# EAGLE design Nixie-Treiber_1_0 (EAGLE 7.3.0)

## Sheet 1 of 3
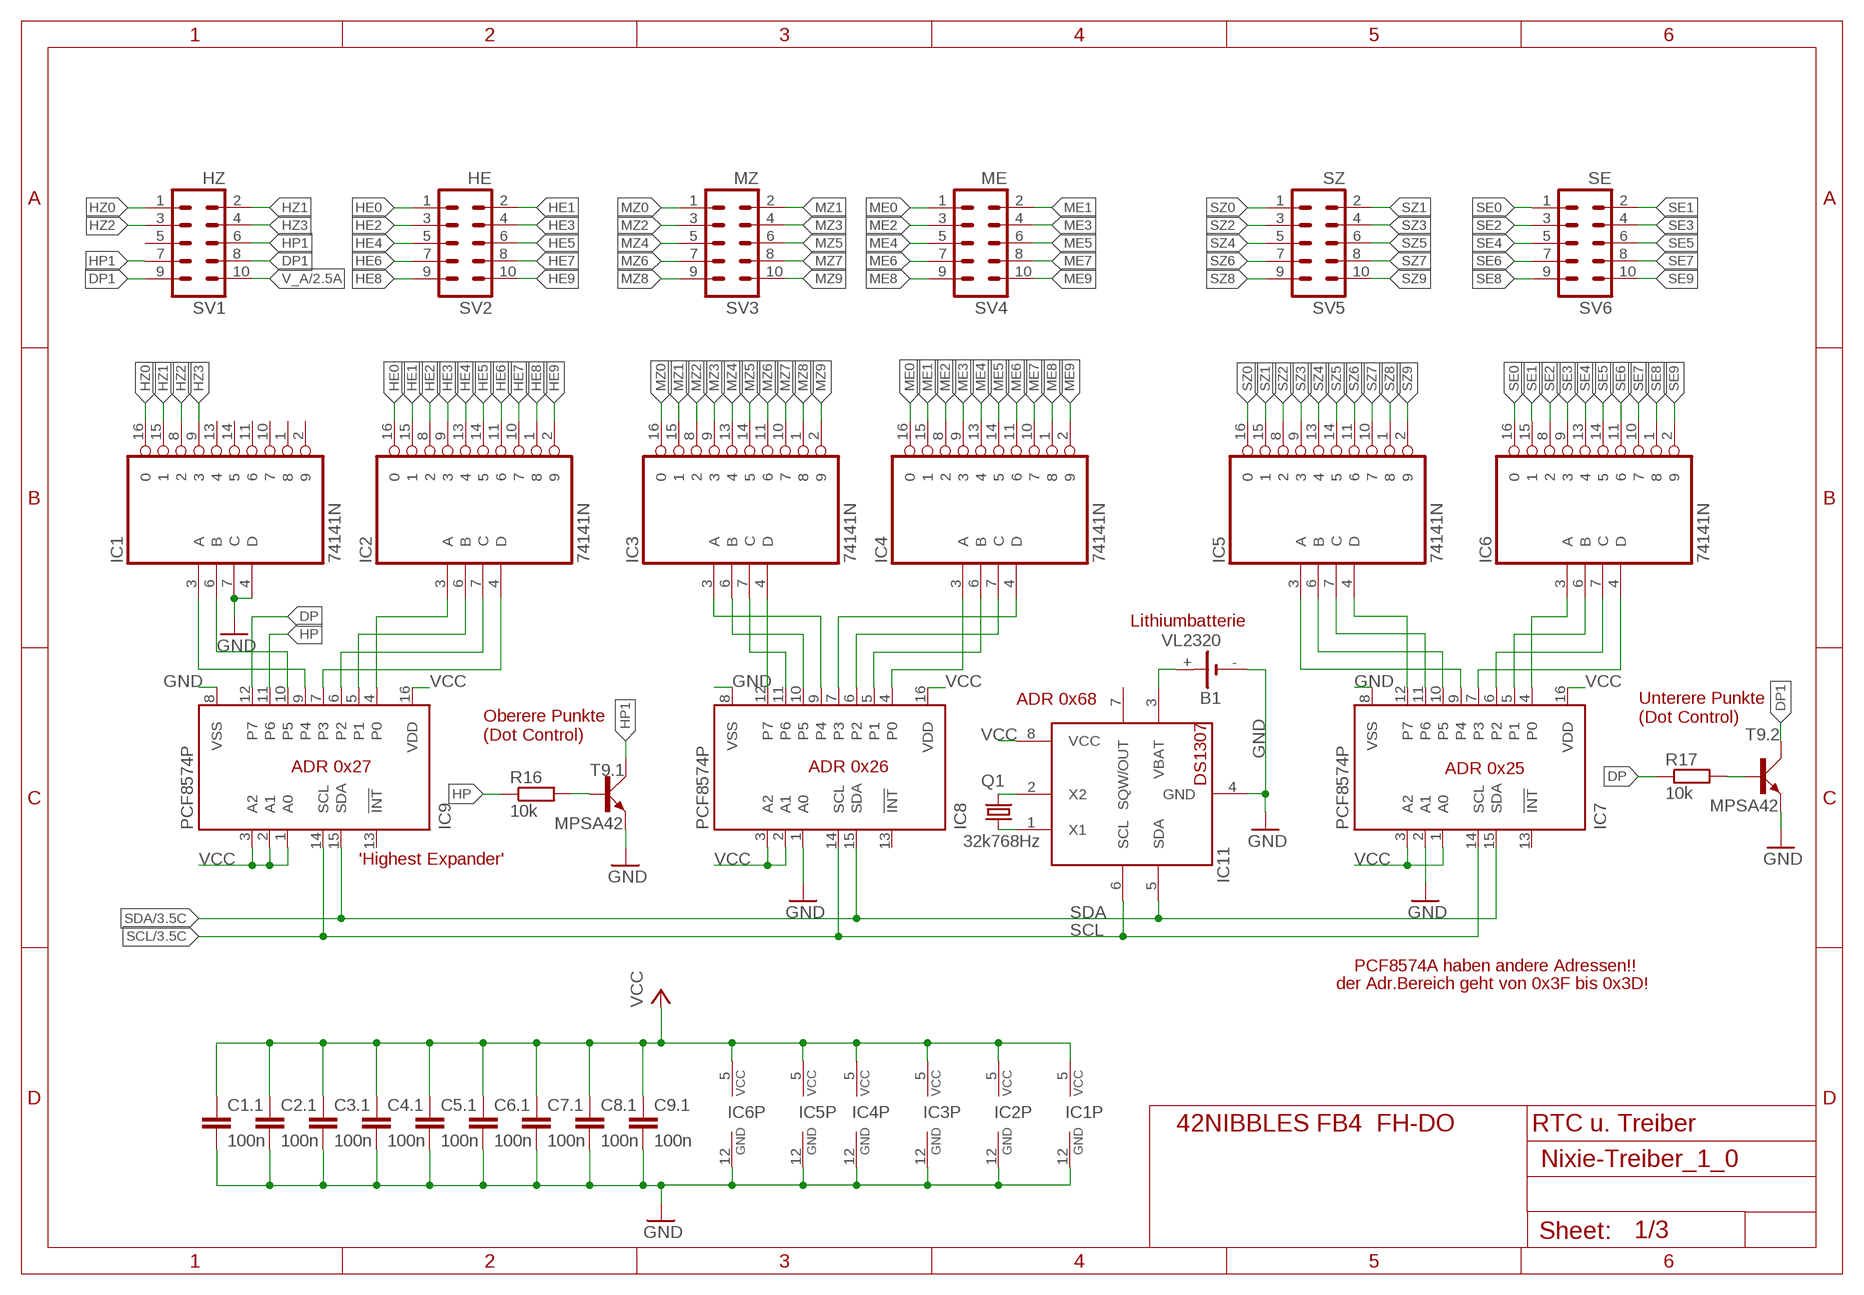
[diagram p0: schematic, sheet 1]

### Parts
B1  VL2320  VL3220  [VL2320]
C1.1  100n  C-EU050-024X044  [C050-024X044]
C2.1  100n  C-EU050-024X044  [C050-024X044]
C3.1  100n  C-EU050-024X044  [C050-024X044]
C4.1  100n  C-EU050-024X044  [C050-024X044]
C5.1  100n  C-EU050-024X044  [C050-024X044]
C6.1  100n  C-EU050-024X044  [C050-024X044]
C7.1  100n  C-EU050-024X044  [C050-024X044]
C8.1  100n  C-EU050-024X044  [C050-024X044]
C9.1  100n  C-EU050-024X044  [C050-024X044]
IC1  74141N  [DIL16]
IC2  74141N  [DIL16]
IC3  74141N  [DIL16]
IC4  74141N  [DIL16]
IC5  74141N  [DIL16]
IC6  74141N  [DIL16]
IC7  PCF8574P  [DIL16]
IC8  PCF8574P  [DIL16]
IC9  PCF8574P  [DIL16]
IC11  DS1307  [DIL08]
Q1  32k768Hz  CRYSTALTC38H  [TC38H]
R16  10k  R-EU_0207/10  [0207/10]
R17  10k  R-EU_0207/10  [0207/10]
SV1  HZ  ML10  [ML10]
SV2  HE  ML10  [ML10]
SV3  MZ  ML10  [ML10]
SV4  ME  ML10  [ML10]
SV5  SZ  ML10  [ML10]
SV6  SE  ML10  [ML10]
T9.1  MPSA42  [TO92D]
T9.2  MPSA42  [TO92D]

### Nets
DP: IC9.12(P7) R17.1
DP1: SV1.8 SV1.9 T9.2.C
GND: B1.- C1.1.2 C2.1.2 C3.1.2 C4.1.2 C5.1.2 C6.1.2 C7.1.2 C8.1.2 C9.1.2 IC1.4(D) IC1.7(C) IC1.12(GND) IC2.12(GND) IC3.12(GND) IC4.12(GND) IC5.12(GND) IC6.12(GND) IC7.2(A1) IC7.8(VSS) IC8.1(A0) IC8.8(VSS) IC9.8(VSS) IC11.4(GND) T9.1.E T9.2.E ; also sheet 2,3
HE0: IC2.16 SV2.1
HE1: IC2.15 SV2.2
HE2: IC2.8 SV2.3
HE3: IC2.9 SV2.4
HE4: IC2.13 SV2.5
HE5: IC2.14 SV2.6
HE6: IC2.11 SV2.7
HE7: IC2.10 SV2.8
HE8: IC2.1 SV2.9
HE9: IC2.2 SV2.10
HP: IC9.11(P6) R16.1
HP1: SV1.6 SV1.7 T9.1.C
HZ0: IC1.16 SV1.1
HZ1: IC1.15 SV1.2
HZ2: IC1.8 SV1.3
HZ3: IC1.9 SV1.4
ME0: IC4.16 SV4.1
ME1: IC4.15 SV4.2
ME2: IC4.8 SV4.3
ME3: IC4.9 SV4.4
ME4: IC4.13 SV4.5
ME5: IC4.14 SV4.6
ME6: IC4.11 SV4.7
ME7: IC4.10 SV4.8
ME8: IC4.1 SV4.9
ME9: IC4.2 SV4.10
MZ0: IC3.16 SV3.1
MZ1: IC3.15 SV3.2
MZ2: IC3.8 SV3.3
MZ3: IC3.9 SV3.4
MZ4: IC3.13 SV3.5
MZ5: IC3.14 SV3.6
MZ6: IC3.11 SV3.7
MZ7: IC3.10 SV3.8
MZ8: IC3.1 SV3.9
MZ9: IC3.2 SV3.10
N$1: IC2.3(A) IC9.4(P0)
N$2: IC2.6(B) IC9.5(P1)
N$3: IC2.7(C) IC9.6(P2)
N$4: IC2.4(D) IC9.7(P3)
N$5: IC1.3(A) IC9.9(P4)
N$6: IC1.6(B) IC9.10(P5)
N$7: R16.2 T9.1.B
N$8: R17.2 T9.2.B
N$9: IC4.3(A) IC8.4(P0)
N$10: IC4.6(B) IC8.5(P1)
N$11: IC4.7(C) IC8.6(P2)
N$12: IC4.4(D) IC8.7(P3)
N$13: IC3.3(A) IC8.9(P4)
N$14: IC3.6(B) IC8.10(P5)
N$15: IC3.7(C) IC8.11(P6)
N$16: IC3.4(D) IC8.12(P7)
N$17: IC6.3(A) IC7.4(P0)
N$18: IC6.6(B) IC7.5(P1)
N$19: IC6.7(C) IC7.6(P2)
N$20: IC6.4(D) IC7.7(P3)
N$21: IC5.3(A) IC7.9(P4)
N$22: IC5.6(B) IC7.10(P5)
N$23: IC5.7(C) IC7.11(P6)
N$24: IC5.4(D) IC7.12(P7)
N$25: IC11.1(X1) Q1.1
N$26: IC11.2(X2) Q1.2
N$27: B1.+ IC11.3(VBAT)
SCL: IC7.14(SCL) IC8.14(SCL) IC9.14(SCL) IC11.6(SCL) ; also sheet 3
SDA: IC7.15(SDA) IC8.15(SDA) IC9.15(SDA) IC11.5(SDA) ; also sheet 3
SE0: IC6.16 SV6.1
SE1: IC6.15 SV6.2
SE2: IC6.8 SV6.3
SE3: IC6.9 SV6.4
SE4: IC6.13 SV6.5
SE5: IC6.14 SV6.6
SE6: IC6.11 SV6.7
SE7: IC6.10 SV6.8
SE8: IC6.1 SV6.9
SE9: IC6.2 SV6.10
SZ0: IC5.16 SV5.1
SZ1: IC5.15 SV5.2
SZ2: IC5.8 SV5.3
SZ3: IC5.9 SV5.4
SZ4: IC5.13 SV5.5
SZ5: IC5.14 SV5.6
SZ6: IC5.11 SV5.7
SZ7: IC5.10 SV5.8
SZ8: IC5.1 SV5.9
SZ9: IC5.2 SV5.10
V_A: SV1.10 ; also sheet 2
VCC: C1.1.1 C2.1.1 C3.1.1 C4.1.1 C5.1.1 C6.1.1 C7.1.1 C8.1.1 C9.1.1 IC1.5(VCC) IC2.5(VCC) IC3.5(VCC) IC4.5(VCC) IC5.5(VCC) IC6.5(VCC) IC7.1(A0) IC7.3(A2) IC7.16(VDD) IC8.2(A1) IC8.3(A2) IC8.16(VDD) IC9.1(A0) IC9.2(A1) IC9.3(A2) IC9.16(VDD) IC11.8(VCC) ; also sheet 2,3
Unconnected: IC1.1 IC1.2 IC1.10 IC1.11 IC1.13 IC1.14 IC7.13(!INT) IC8.13(!INT) IC9.13(!INT) IC11.7(SQW/OUT) SV1.5

### Notes on the sheet
- Lithiumbatterie
- ADR 0x68
- Unterere Punkte
  (Dot Control)
- Oberere Punkte
  (Dot Control)
- ADR 0x27 | ADR 0x26 | ADR 0x25
- 'Highest Expander'
- PCF8574A haben andere Adressen!!
- der Adr.Bereich geht von 0x3F bis 0x3D!
- 42NIBBLES FB4  FH-DO | RTC u. Treiber

## Sheet 2 of 3
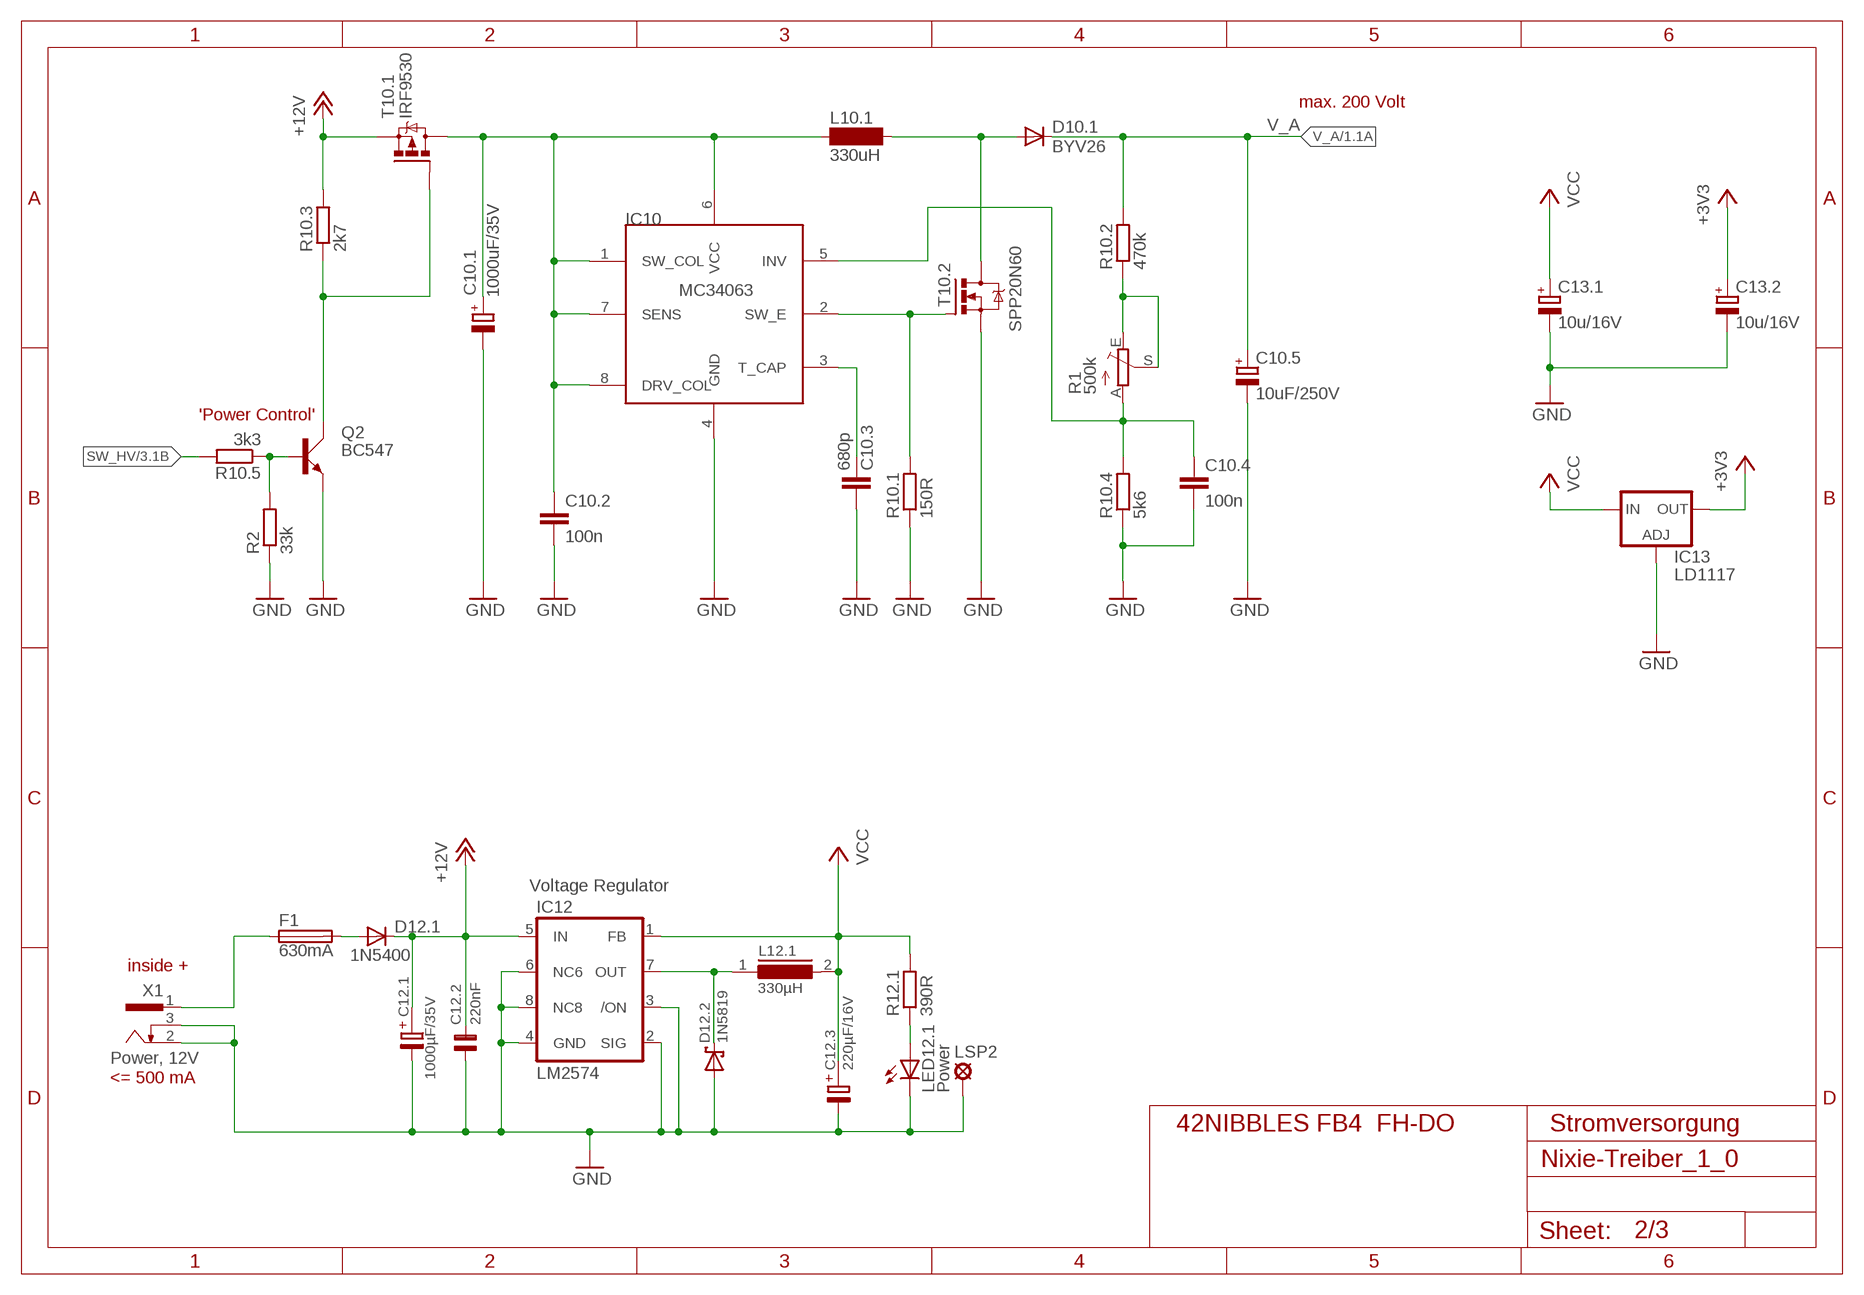
[diagram p1: schematic, sheet 2]

### Parts
C10.1  1000uF/35V  CPOL-EUE5-13  [E5-13]
C10.2  100n  C-EU050-030X075  [C050-030X075]
C10.3  680p  C-EU025-025X050  [C025-025X050]
C10.4  100n  C-EU050-030X075  [C050-030X075]
C10.5  10uF/250V  CPOL-EUE5-13  [E5-13]
C12.1  1000µF/35V  E5-13  [E5-13]
C12.2  220nF  C5B2,5  [C5B2,5]
C12.3  220µF/16V  E5-10,5  [E5-10,5]
C13.1  10u/16V  CPOL-EUE1.8-4  [E1,8-4]
C13.2  10u/16V  CPOL-EUE1.8-4  [E1,8-4]
D10.1  BYV26  1N5059  [DO204-10]
D12.1  1N5400  [DO201-15]
D12.2  1N5819  1N5908  [DO35-10]
F1  630mA  SH22,5  [SH22,5]
IC10  MC34063  [DIL08]
IC12  LM2574  [LM2574]
IC13  LD1117  LD117ADT-TR  [DPACK]
L10.1  330uH  SD12K100  [SD12K100]
L12.1  330µH  DS10  [SD12-K]
LED12.1  Power  LED3MM  [LED3MM]
LSP2  SE11  [SE11]
Q2  BC547  [SOT54A]
R1  500k  TRIM_EU-ST15  [ST15]
R2  33k  R-EU_0207/10  [0207/10]
R10.1  150R  R-EU_0207/10  [0207/10]
R10.2  470k  R-EU_0207/10  [0207/10]
R10.3  2k7  R-EU_0207/10  [0207/10]
R10.4  5k6  R-EU_0207/10  [0207/10]
R10.5  3k3  R-EU_0207/10  [0207/10]
R12.1  390R  R-EU_0207/10  [0207/10]
T10.1  IRF9530  [TO220BV]
T10.2  SPP20N60  IRF740  [TO220BV]
X1  Power, 12V  HEBW21  [HEBW21]

### Nets
+3V3: C13.2.+ IC13.4(OUT) ; also sheet 3
+12V: C12.1.+ C12.2.2 D12.1.C IC12.5(IN) R10.3.2 T10.1.S
GND: C10.1.- C10.2.2 C10.3.2 C10.4.2 C10.5.- C12.1.- C12.2.1 C12.3.- C13.1.- C13.2.- D12.2.A IC10.4(GND) IC12.2(SIG) IC12.3(/ON) IC12.4(GND) IC12.6(NC6) IC12.8(NC8) IC13.1(ADJ) LED12.1.K(C) LSP2.MP Q2.E R2.1 R10.1.1 R10.4.1 T10.2.S X1.2 X1.3 ; also sheet 1,3
HV_IN: C10.1.+ C10.2.1 IC10.1(SW_COL) IC10.6(VCC) IC10.7(SENS) IC10.8(DRV_COL) L10.1.1 T10.1.D
N$30: C10.3.1 IC10.3(T_CAP)
N$31: IC10.2(SW_E) R10.1.2 T10.2.G
N$32: D10.1.A L10.1.2 T10.2.D
N$33: D12.2.K IC12.7(OUT) L12.1.1
N$34: C10.4.1 IC10.5(INV) R1.A R10.4.2
N$35: R1.E R1.S R10.2.1
N$36: LED12.1.A R12.1.1
N$37: Q2.C R10.3.1 T10.1.G
N$38: D12.1.A F1.2
N$41: Q2.B R2.2 R10.5.1
SW_HV: R10.5.2 ; also sheet 3
V_A: C10.5.+ D10.1.C R10.2.2 ; also sheet 1
VCC: C12.3.+ C13.1.+ IC12.1(FB) IC13.3(IN) L12.1.2 R12.1.2 ; also sheet 1,3
VIN: F1.1 X1.1

### Notes on the sheet
- max. 200 Volt
- 'Power Control'
- Voltage Regulator
- inside +
- <= 500 mA
- 42NIBBLES FB4  FH-DO | Stromversorgung

## Sheet 3 of 3
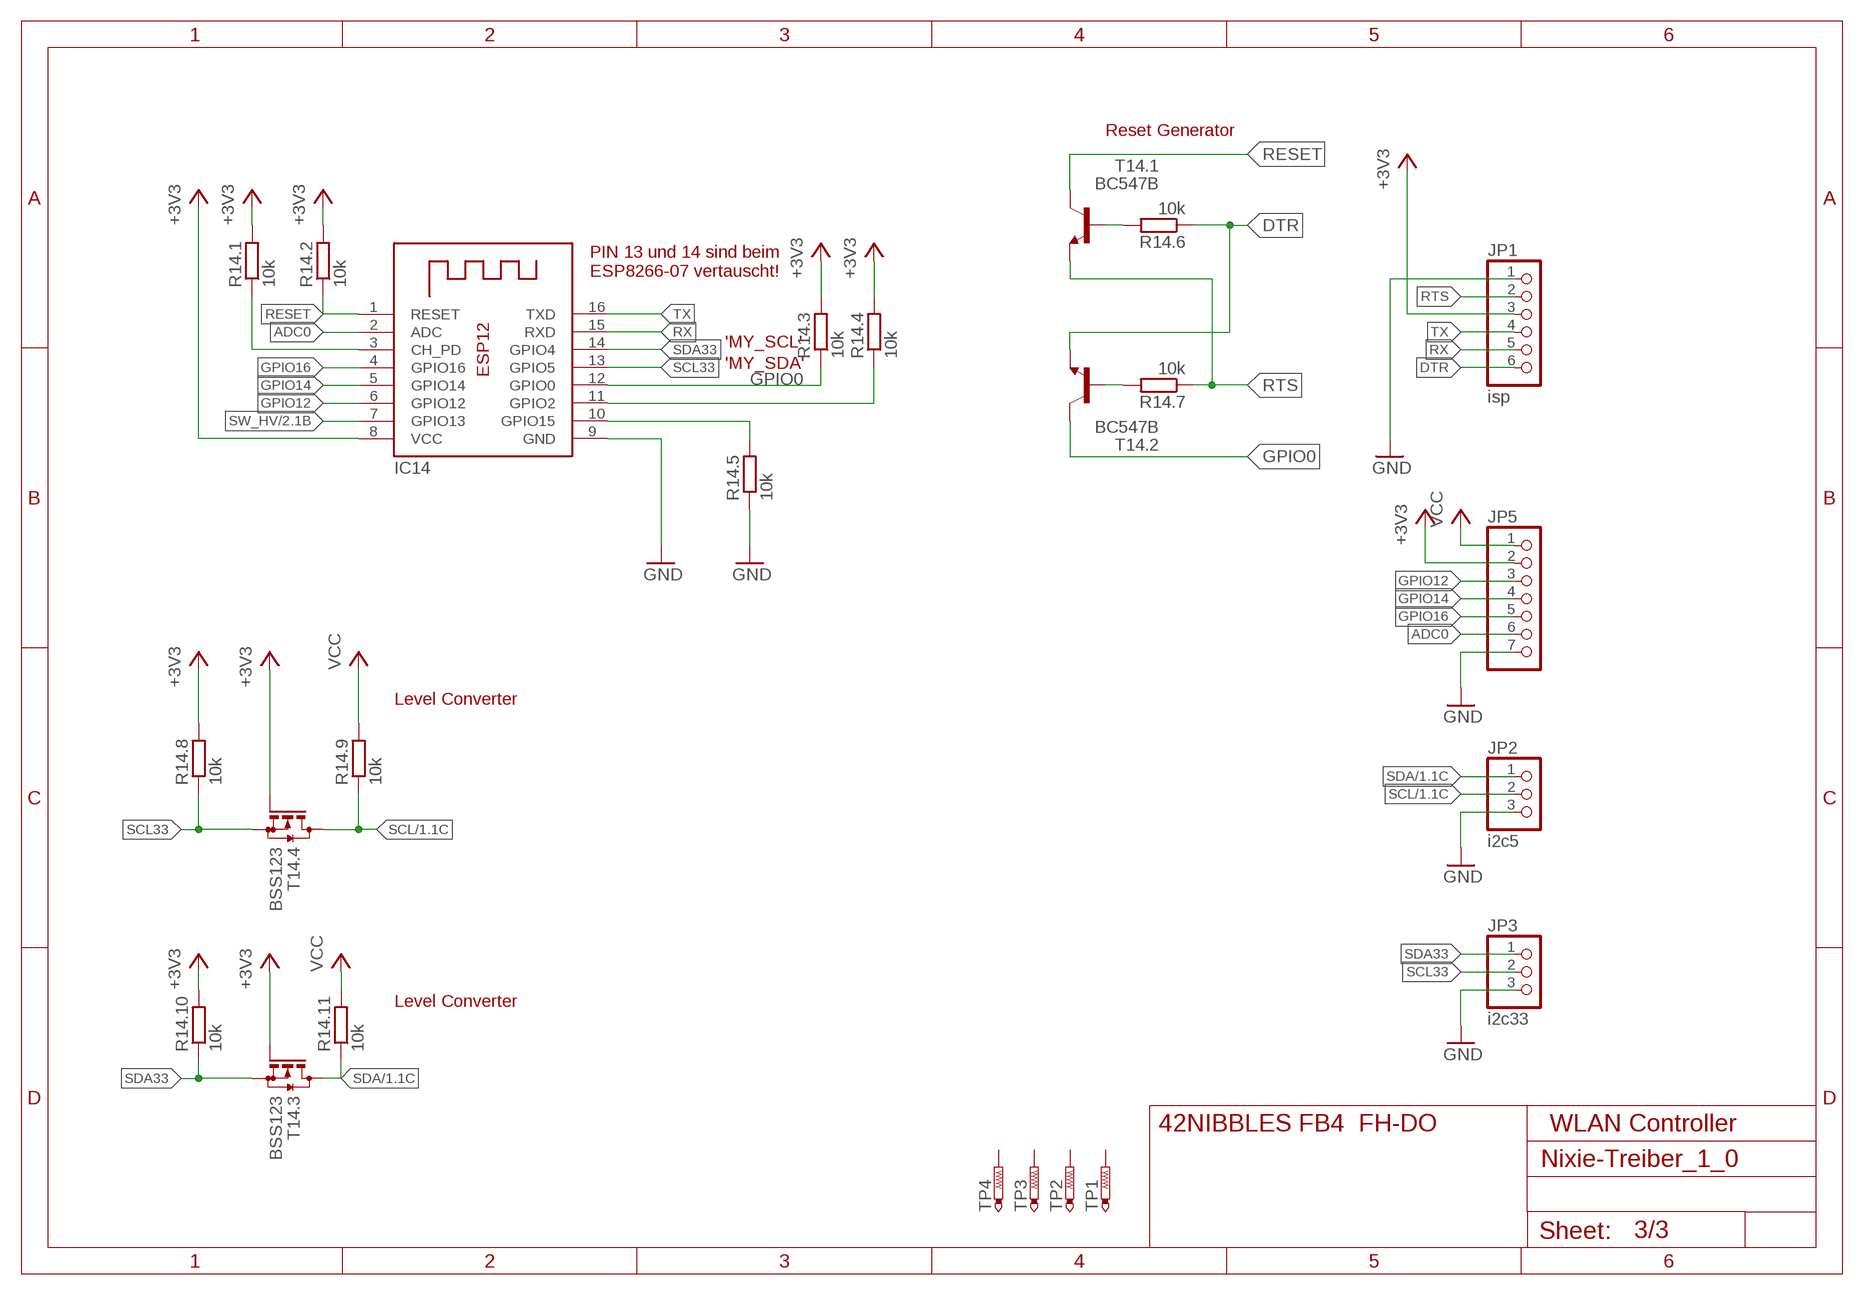
[diagram p2: schematic, sheet 3]

### Parts
IC14  ESP07  ESP-12  [ESP-12]
JP1  isp  PINHD-1X6/90  [1X06/90]
JP2  i2c5  PINHD-1X3  [1X03]
JP3  i2c33  PINHD-1X3  [1X03]
JP5  PINHD-1X7/90  [1X07/90]
R14.1  10k  R-EU_0207/10  [0207/10]
R14.2  10k  R-EU_0207/10  [0207/10]
R14.3  10k  R-EU_0207/10  [0207/10]
R14.4  10k  R-EU_0207/10  [0207/10]
R14.5  10k  R-EU_0207/10  [0207/10]
R14.6  10k  R-EU_0207/10  [0207/10]
R14.7  10k  R-EU_0207/10  [0207/10]
R14.8  10k  R-EU_0207/10  [0207/10]
R14.9  10k  R-EU_0207/10  [0207/10]
R14.10  10k  R-EU_0207/10  [0207/10]
R14.11  10k  R-EU_0207/10  [0207/10]
T14.1  BC547B  [TO92]
T14.2  BC547B  [TO92]
T14.3  BSS123  [SOT23]
T14.4  BSS123  [SOT23]
TP1  PTR1B1,27  [B1,27]
TP2  PTR1B1,27  [B1,27]
TP3  PTR1B1,27  [B1,27]
TP4  PTR1B1,27  [B1,27]

### Nets
+3V3: IC14.8(VCC) JP1.3 JP5.2 R14.1.2 R14.2.2 R14.3.2 R14.4.2 R14.8.2 R14.10.2 T14.3.1(G) T14.4.1(G) ; also sheet 2
ADC0: IC14.2(ADC) JP5.6
DTR: JP1.6 R14.6.1 T14.2.1(E)
GND: IC14.9(GND) JP1.1 JP2.3 JP3.3 JP5.7 R14.5.1 ; also sheet 1,2
GPIO0: IC14.12(GPIO0) R14.3.1 T14.2.3(C)
GPIO12: IC14.6(GPIO12) JP5.3
GPIO14: IC14.5(GPIO14) JP5.4
GPIO16: IC14.4(GPIO16) JP5.5
N$28: IC14.10(GPIO15) R14.5.2
N$39: IC14.11(GPIO2) R14.4.1
N$42: IC14.3(CH_PD) R14.1.1
N$44: R14.7.2 T14.2.2(B)
N$45: R14.6.2 T14.1.2(B)
RESET: IC14.1(RESET) R14.2.1 T14.1.3(C)
RTS: JP1.2 R14.7.1 T14.1.1(E)
RX: IC14.15(RXD) JP1.5
SCL: JP2.2 R14.9.1 T14.4.3(D) ; also sheet 1
SCL33: IC14.13(GPIO5) JP3.2 R14.8.1 T14.4.2(S)
SDA: JP2.1 R14.11.1 T14.3.3(D) ; also sheet 1
SDA33: IC14.14(GPIO4) JP3.1 R14.10.1 T14.3.2(S)
SW_HV: IC14.7(GPIO13) ; also sheet 2
TX: IC14.16(TXD) JP1.4
VCC: JP5.1 R14.9.2 R14.11.2 ; also sheet 1,2
Unconnected: TP1.TP TP2.TP TP3.TP TP4.TP

### Notes on the sheet
- Reset Generator
- PIN 13 und 14 sind beim
  ESP8266-07 vertauscht!
- 'MY_SCL'
- 'MY_SDA'
- IC14
- Level Converter
- Level Converter
- 42NIBBLES FB4  FH-DO | WLAN Controller

## Library data of the parts
B1 = battery:VL3220
C1.1 C2.1 C3.1 C4.1 C5.1 C6.1 C7.1 C8.1 C9.1 C10.2-C10.4 = rcl:C-EU: CAPACITOR, European symbol
C10.1 C10.5 C13.1 C13.2 = rcl:CPOL-EU: POLARIZED CAPACITOR, European symbol
C12.1 = POLCAP:E5-13
C12.2 = CAP:C5B2,5
C12.3 = POLCAP@2:E5-10,5
D10.1 = diode:1N5059: DIODE controlled avalanche rectifier
D12.1 = diode:1N5400: DIODE standard rectifier, 3 A, 50 V (Motorola)
D12.2 = diode:1N5908
F1 = fuse:SH22,5: FUSE HOLDER grid 22,5 mm, OGN0031 8201, Schurter (Buerklin); MF: SCHURTER; MPN: 0031.8201; OC_FARNELL: 1162740; OC_NEWARK: 96F8317
IC1-IC6 = 74-NIXIE:74*141: BCD to decimal DECODER/DRIVER
IC7-IC9 = micro-philips:PCF8574: I2C-Bus Remote 8-bit I/O expander http://www.semiconductors.philips.com/acrobat_download/datasheets/PCF8574_4.pdf; MPN: PCF8574PN; OC_FARNELL: 204020; OC_NEWARK: 11N8515
IC10 = texas:MC34063: MC34063 Switching Regulator Buck-Boost
IC11 = adafruit:DS1307: DS1307 Real time clock (RTC) with battery backup ability. Talk to it via i2c
IC12 = V-SWITCH:LM2574
IC13 = v-reg:LD117A?*: Low drop fixed and adjustable positive voltage regulators 1 A Source: http://www.st.com/stonline/products/literature/ds/7194/ld1117axx.pdf
IC14 = adafruit:ESP-12
JP1 = pinhead:PINHD-1X6: PIN HEADER
JP2 JP3 = pinhead:PINHD-1X3: PIN HEADER
JP5 = pinhead:PINHD-1X7: PIN HEADER
L10.1 = inductor-neosid:SD12: INDUCTOR nominal inductance; OC_FARNELL: unknown; OC_NEWARK: unknown
L12.1 = IND-A:DS10
LED12.1 = led:LED: LED OSRAM: - CHIPLED LG R971, LG N971, LY N971, LG Q971, LY Q971, LO R971, LY R971 LH N974, LH R974 LS Q976, LO Q976, LY Q976 LO Q996 - Hyper CHIPLED LW Q18S LB Q993, LB Q99A, LB R99A - SideLED LS A670, LO A670, LY A670, LG A670, LP A670 LB A673, LV A673, LT A673, LW A673 LH A674 LY A675 LS A676, LA A676, LO A676, LY A676, LW A676 LS A679, LY A679, LG A679 - Hyper Micro SIDELED® LS Y876, LA Y876, LO Y876, LY Y876 LT Y87S - SmartLED LW L88C, LW L88S LB L89C, LB L89S, LG L890 LS L89K, LO L89K, LY L89K LS L896, LA L896, LO L896, LY L896 - TOPLED LS T670, LO T670, LY T670, LG T670, LP T670 LSG T670, LSP T670, LSY T670, LOP T670, LYG T670 LG T671, LOG T671, LSG T671 LB T673, LV T673, LT T673, LW T673 LH T674 LS T676, LA T676, LO T676, LY T676, LB T676, LH T676, LSB T676, LW T676 LB T67C, LV T67C, LT T67C, LS T67K, LO T67K, LY T67K, LW E67C LS E67B, LA E67B, LO E67B, LY E67B, LB E67C, LV E67C, LT E67C LW T67C LS T679, LY T679, LG T679 LS T770, LO T770, LY T770, LG T770, LP T770 LB T773, LV T773, LT T773, LW T773 LH T774 LS E675, LA E675, LY E675, LS T675 LS T776, LA T776, LO T776, LY T776, LB T776 LHGB T686 LT T68C, LB T68C - Hyper Mini TOPLED® LB M676 - Mini TOPLED Santana® LG M470 LS M47K, LO M47K, LY M47K Source: http://www.osram.convergy.de - LUMILED® LXK2-PW12-R00, LXK2-PW12-S00, LXK2-PW14-U00, LXK2-PW14-V00 LXK2-PM12-R00, LXK2-PM12-S00, LXK2-PM14-U00 LXK2-PE12-Q00, LXK2-PE12-R00, LXK2-PE12-S00, LXK2-PE14-T00, LXK2-PE14-U00 LXK2-PB12-K00, LXK2-PB12-L00, LXK2-PB12-M00, LXK2-PB14-N00, LXK2-PB14-P00, LXK2-PB14-Q00 LXK2-PR12-L00, LXK2-PR12-M00, LXK2-PR14-Q00, LXK2-PR14-R00 LXK2-PD12-Q00, LXK2-PD12-R00, LXK2-PD12-S00 LXK2-PH12-R00, LXK2-PH12-S00 LXK2-PL12-P00, LXK2-PL12-Q00, LXK2-PL12-R00 Source: www.luxeon.com
LSP2 = solpad:SE11: SOLDER PAD RTM, drill 1,1mm, distributor Buerklin, 07F810
Q1 = crystal:CRYSTAL: CRYSTAL; OC_FARNELL: unknown; OC_NEWARK: unknown
Q2 = transistor-small-signal:BC547: NPN TRANSISTOR
R1 = pot:TRIM_EU-: POTENTIOMETER
R2 R10.1-R10.5 R12.1 R14.1-R14.11 R16 R17 = rcl:R-EU_: RESISTOR, European symbol
SV1-SV6 = con-harting-ml:ML10: HARTING; OC_FARNELL: unknown; OC_NEWARK: unknown
T9.1 T9.2 = transistor-small-signal:MPSA42: MPSA42 Uce=400V EBC!
T10.1 = transistor-power:IRF9530: P-CHANNEL HEXFET POWER-MOS-FET Source: http://www.irf.com/product-info/datasheets/data/irf9530.pdf
T10.2 = transistor-power:IRF740: N-CHANNEL MOS FET
T14.1 T14.2 = transistor-npn:BC547*: NPN Transistor
T14.3 T14.4 = transistor-small-signal:BSS123: N-CHANNEL MOS FET
TP1-TP4 = testpad:PTR1: TEST PIN
X1 = con-conrad:HEBW21

## Board
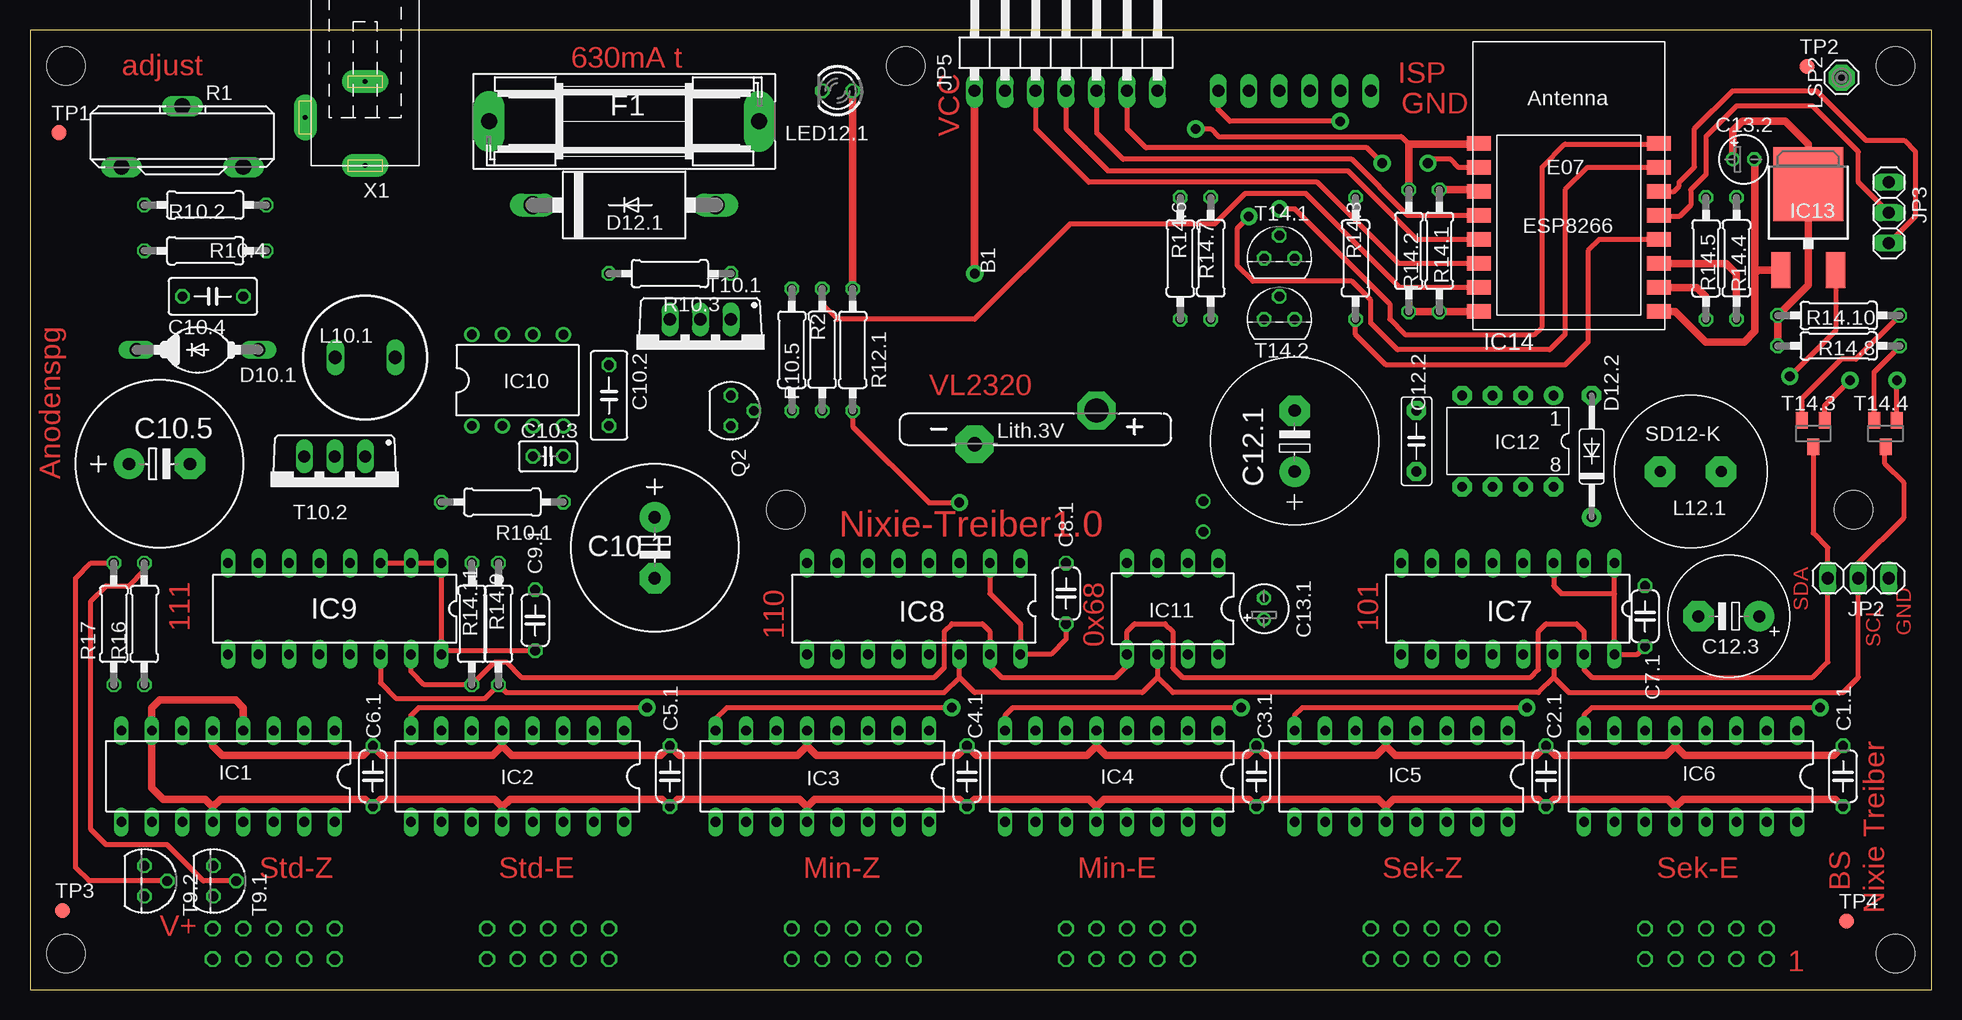
[diagram p3: board, top side]
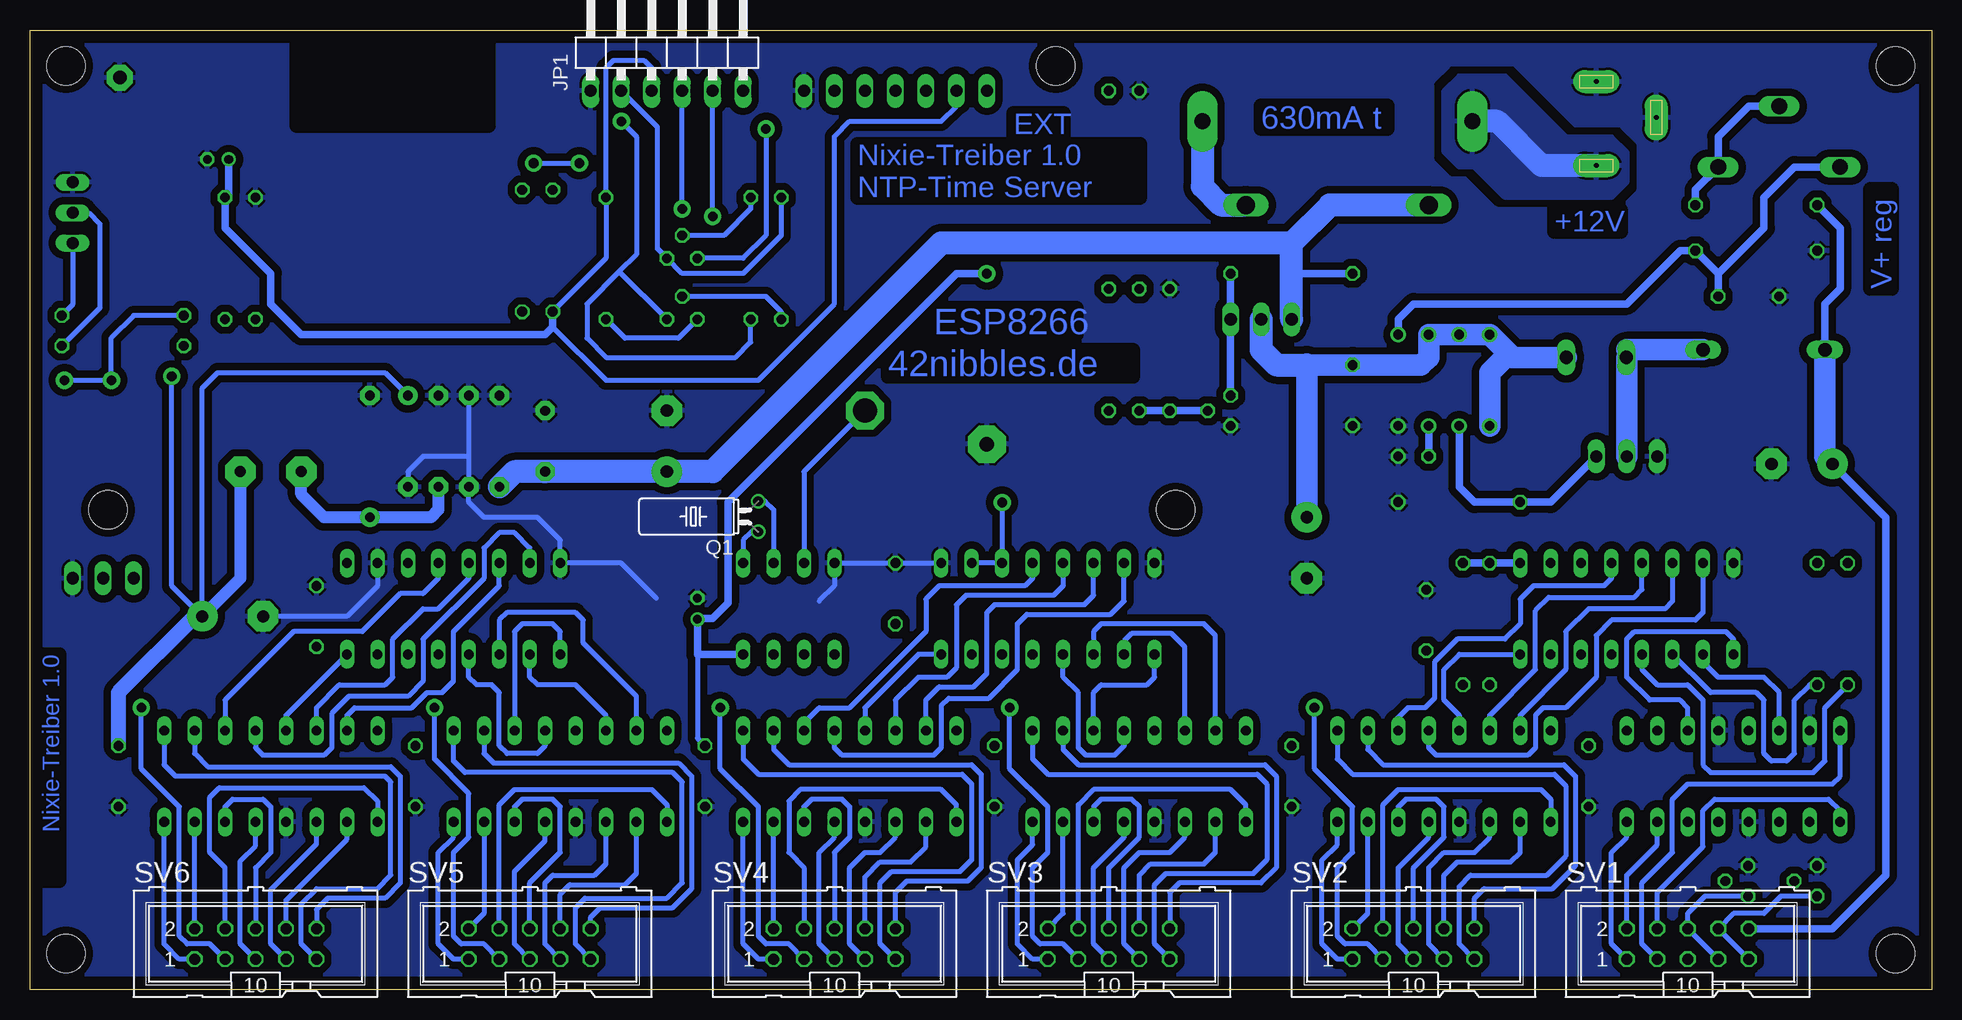
[diagram p4: board, bottom side, seen from below]

Size 158.5 x 80 mm. Coordinates in mm from the lower left corner, seen from the top.
Outline: 0,0 158.5,0 158.5,80 0,80 0,0
Copper layers (1*16): Top 0.035mm / dielectric 1.5mm / Bottom 0.035mm
Design rules "PCB-POOL Standard *": minimum track width 0.15mm, minimum drill 0.3mm, track to track 0.15mm, track to pad 0.15mm, pad to pad 0.15mm, via to via 0.15mm, smd to smd 0.15mm, copper to edge 0.3mm, drill to drill 0.2mm, minimum pad ring 0.2mm, minimum via ring 0.15mm, stop-mask expansion 0.075mm, vias tented up to drill 0mil, thermal gap 0.2mm
Holes 3.2 mm at 3,3 155.5,3 155.5,77 3,77 63,40 152,40 73,77

### Footprints (pad centres in the part's own frame; a part is rotated, then mirrored left to right if it is on the bottom)
VL2320 = drill 2 pad 3.15 octagon: + 1.27,-6.35 | drill 1.2 pad 3.15 octagon: - -1.524,3.81
C050-024X044 = drill 0.813 octagon: 1 -2.54,0; 2 2.54,0
E5-13 = drill 1.016 pad 2.54: + -2.54,0 | drill 1.016 pad 2.54 octagon: - 2.54,0
C050-030X075 = drill 0.813 octagon: 1 -2.54,0; 2 2.54,0
C025-025X050 = drill 0.813 octagon: 1 -1.27,0; 2 1.27,0
C5B2,5 = drill 0.813 pad 1.6 octagon: 1 -2.54,0; 2 2.54,0
E5-10,5 = drill 1.016 pad 2.54: + -2.54,0 | drill 1.016 pad 2.54 octagon: - 2.54,0
E1,8-4 = drill 0.711 pad 1.168: + -0.889,0 | drill 0.711 pad 1.168 octagon: - 0.889,0
DO204-10 = drill 1.118 long: A 5.08,0; C -5.08,0
DO201-15 = drill 1.499 long: A 7.62,0; C -7.62,0
DO35-10 = drill 0.813 pad 1.6 octagon: A 5.08,0 | drill 0.813 pad 1.6: K -5.08,0
SH22,5 = drill 1.321 pad 2.54 long: 1 -11.252,0; 2 11.252,0
DIL16 = drill 0.813 long: 1 -8.89,-3.81; 2 -6.35,-3.81; 3 -3.81,-3.81; 4 -1.27,-3.81; 5 1.27,-3.81; 6 3.81,-3.81; 7 6.35,-3.81; 8 8.89,-3.81; 9 8.89,3.81; 10 6.35,3.81; 11 3.81,3.81; 12 1.27,3.81; 13 -1.27,3.81; 14 -3.81,3.81; 15 -6.35,3.81; 16 -8.89,3.81
DIL08 = drill 0.813 pad 1.27: 1 -3.81,-3.81; 2 -1.27,-3.81; 3 1.27,-3.81; 4 3.81,-3.81; 5 3.81,3.81; 6 1.27,3.81; 7 -1.27,3.81; 8 -3.81,3.81
DIL08' = drill 0.813 long: 1 -3.81,-3.81; 2 -1.27,-3.81; 3 1.27,-3.81; 4 3.81,-3.81; 5 3.81,3.81; 6 1.27,3.81; 7 -1.27,3.81; 8 -3.81,3.81
LM2574 = drill 0.813 pad 1.6: 1 -3.81,-3.81 | drill 0.813 pad 1.6 octagon: 2 -1.27,-3.81; 3 1.27,-3.81; 4 3.81,-3.81; 5 3.81,3.81; 6 1.27,3.81; 7 -1.27,3.81; 8 -3.81,3.81
DPACK = smd 1.6 x 3: 1 -2.28,-4.8; 3 2.28,-4.8 | smd 5.8 x 6.2: 4 0,2.38
ESP-12 = smd 2 x 1.2: 1 -7.5,4.5; 2 -7.5,2.5; 3 -7.5,0.5; 4 -7.5,-1.5; 5 -7.5,-3.5; 6 -7.5,-5.5; 7 -7.5,-7.5; 8 -7.5,-9.5; 9 7.5,-9.5; 10 7.5,-7.5; 11 7.5,-5.5; 12 7.5,-3.5; 13 7.5,-1.5; 14 7.5,0.5; 15 7.5,2.5; 16 7.5,4.5
1X06/90 = drill 1.016 long: 1 -6.35,-3.81; 2 -3.81,-3.81; 3 -1.27,-3.81; 4 1.27,-3.81; 5 3.81,-3.81; 6 6.35,-3.81
1X03 = drill 1.016 long: 1 -2.54,0; 2 0,0; 3 2.54,0
1X07/90 = drill 1.016 long: 1 -7.62,-3.81; 2 -5.08,-3.81; 3 -2.54,-3.81; 4 0,-3.81; 5 2.54,-3.81; 6 5.08,-3.81; 7 7.62,-3.81
SD12K100 = drill 1.1 long: 1 -2.5,0; 2 2.5,0
SD12-K = drill 0.914 pad 2.54 octagon: 1 -2.54,0; 2 2.54,0
LED3MM = drill 0.813 octagon: A -1.27,0; K 1.27,0
SE11 = drill 1.118 pad 2.159 octagon: MP 0,0
TC38H = drill 0.813: 1 -1.27,0; 2 1.27,0
SOT54A = drill 0.813 octagon: B 0,1.905; C -1.27,0; E 1.27,0
ST15 = drill 1.321 long: A -5.08,-2.54; E 5.08,-2.54; S 0,2.54
0207/10 = drill 0.813 octagon: 1 -5.08,0; 2 5.08,0
ML10 = drill 0.914 octagon: 1 -5.08,-1.27; 2 -5.08,1.27; 3 -2.54,-1.27; 4 -2.54,1.27; 5 0,-1.27; 6 0,1.27; 7 2.54,-1.27; 8 2.54,1.27; 9 5.08,-1.27; 10 5.08,1.27
TO92D = drill 0.813 octagon: B 0,1.905; C 1.27,0; E -1.27,0
TO220BV = drill 1.016 long: D 0,-2.54; G -2.54,-2.54; S 2.54,-2.54
TO92 = drill 0.813 octagon: 1 1.27,0; 2 0,1.905; 3 -1.27,0
SOT23 = smd 1 x 1.4: 1 -0.95,-1.1; 2 0.95,-1.1; 3 0,1.1
B1,27 = smd 1.27 x 1.27: TP 0,0
HEBW21 = drill 0.4 pad 1.93 long: 1 0,7.5; 2 0,0.5; 3 5,3.5

### Placement (x,y rotation side)
B1  82.55,46.99 90 top
C1.1  151.13,17.78 270 top
C2.1  126.36,17.78 270 top
C3.1  102.23,17.78 270 top
C4.1  78.11,17.78 270 top
C5.1  53.34,17.78 270 top
C6.1  28.57,17.78 270 top
C7.1  134.62,31.11 90 top
C8.1  86.36,33.02 90 top
C9.1  42.11,30.79 90 top
C10.1  52.07,36.83 270 top
C10.2  48.26,49.53 270 top
C10.3  43.18,44.45 0 top
C10.4  15.24,57.78 180 top
C10.5  10.79,43.81 0 top
C12.1  105.41,45.72 90 top
C12.2  115.57,45.72 270 top
C12.3  141.6,31.11 180 top
C13.1  102.87,31.75 90 top
C13.2  142.83,69.22 0 top
D10.1  13.97,53.34 0 top
D12.1  49.53,65.41 0 top
D12.2  130.18,44.45 90 top
F1  49.53,72.39 0 top
IC1  16.51,17.78 180 top
IC2  40.64,17.78 180 top
IC3  66.04,17.78 180 top
IC4  90.17,17.78 180 top
IC5  114.3,17.78 180 top
IC6  138.43,17.78 180 top
IC7  123.19,31.75 180 top
IC8  73.66,31.75 180 top
IC9  25.4,31.75 180 top
IC10  40.64,50.8 0 top
IC11  DS1307  [DIL08']  95.25,31.75 180 top
IC12  123.19,45.72 180 top
IC13  148.22,64.77 0 top
IC14  128.27,66.04 0 top
JP1  105.41,78.74 0 bottom
JP2  152.4,34.29 0 top
JP3  154.94,64.77 90 top
JP5  86.36,78.74 0 top
L10.1  27.94,52.7 180 top
L12.1  138.43,43.18 0 top
LED12.1  67.31,74.93 180 top
LSP2  151,76.03 270 top
Q1  97.81,39.43 90 bottom
Q2  58.42,48.26 270 top
R1  12.7,71.12 0 top
R2  63.5,53.34 270 top
R10.1  39.37,40.64 180 top
R10.2  14.61,65.41 180 top
R10.3  53.34,59.69 180 top
R10.4  14.61,61.59 0 top
R10.5  66.04,53.34 90 top
R12.1  68.58,53.34 270 top
R14.1  117.47,61.59 270 top
R14.2  114.94,61.59 270 top
R14.3  110.49,60.96 90 top
R14.4  142.24,60.96 90 top
R14.5  139.7,60.96 270 top
R14.6  98.42,60.96 90 top
R14.7  95.89,60.96 270 top
R14.8  150.76,53.66 180 top
R14.9  39.05,30.48 90 top
R14.10  150.76,56.2 180 top
R14.11  36.83,30.48 90 top
R16  9.53,30.48 90 top
R17  6.99,30.48 90 top
SV1  20.32,3.81 0 bottom
SV2  43.18,3.81 0 bottom
SV3  68.58,3.81 0 bottom
SV4  91.44,3.81 0 bottom
SV5  116.84,3.81 0 bottom
SV6  139.7,3.81 0 bottom
T9.1  15.29,9.05 270 top
T9.2  9.54,9.05 270 top
T10.1  55.88,53.34 180 top
T10.2  25.4,41.91 180 top
T14.1  104.14,60.96 0 top
T14.2  104.14,55.88 0 top
T14.3  148.64,46.35 180 top
T14.4  154.67,46.35 180 top
TP1  2.4,71.44 0 top
TP2  148.13,76.97 0 top
TP3  2.72,6.6 0 top
TP4  151.4,5.71 0 top
X1  27.94,76.2 180 top

### Tracks (layer width: path | path; a pad name or v marks a point on that pad's centre or on a via)
+3V3  (via drill 0.8)
  Top 0.406: T14.3.1 149.59,48.67 v151.72,50.8 | T14.4.1 v155.62,50.8
  Top 0.61: R14.2.2 R14.1.2 120.75,56.52 IC14.8 | R14.8.2 R14.10.2 148.22,58.74 IC13.4 148.22,70.48 146.32,72.39 142.71,72.39 141.94,71.62 C13.2.+
  Bottom 0.406: JP1.3 106.68,76.83 107.31,77.47 109.86,77.47 110.49,76.83 R14.3.2 110.49,60.96 R14.2.2 | 114.94,55.24 110.49,50.8 97.79,50.8 91.44,57.15 91.44,71.12 90.17,72.39 82.55,72.39 81.28,73.66 JP5.2 | v155.62,50.8 v151.72,50.8 151.72,54.34 149.86,56.2 R14.10.2
  Bottom 0.61: R14.2.2 114.94,55.24 115.57,54.61 135.89,54.61 138.43,57.15 138.43,59.69 142.24,63.5 R14.4.2 141.94,66.34 C13.2.+
+12V
  Bottom 0.61: R10.3.2 53.34,59.69
  Bottom 1.93: IC12.5 118.11,43.18 C12.2.2 C12.1.+ 101.6,43.18 82.55,62.23 53.34,62.23 | D12.1.C 50.16,65.41 53.34,62.23 | T10.1.S 53.34,59.69 53.34,62.23
ADC0  (via drill 0.8)
  Top 0.406: IC14.2 119.1,68.54 118.43,69.22 116.84,69.22 v116.52,68.9 | v112.71,68.9 111.44,70.17 93.03,70.17 91.44,71.75 JP5.6
  Bottom 0.406: v116.52,68.9 v112.71,68.9
DP
  Bottom 0.406: IC9.12 24.13,26.67 22.86,25.4 20.32,25.4 19.05,24.13 19.05,18.73 18.41,18.1 9.84,18.1 8.89,19.05 8.89,23.5 R17.1
DP1
  Bottom 0.406: SV1.9 SV1.8 16.51,6.35 13.97,6.35 12.54,7.78 T9.2.C
DTR  (via drill 0.8)
  Top 0.406: v109.22,72.39 100.01,72.39 99.06,73.34 JP1.6
  Bottom 0.406: R14.6.1 98.42,53.98 99.69,52.7 110.49,52.7 112.08,54.29 112.08,57.15 109.38,59.85 | v109.22,72.39 107.95,71.12 107.95,61.28 109.38,59.85 | T14.2.1 109.38,59.85
GND
  Top 0.61: IC14.9 137.13,56.54 139.7,53.98 142.88,53.98 143.78,54.88 143.78,59.69 | 143.78,59.69 143.78,69.15 C13.2.- | C1.1.2 150.5,15.88 137.79,15.88 137.16,15.24 | 137.16,15.24 IC6.12 | 137.16,15.24 136.53,15.88 127,15.88 C2.1.2 125.73,15.88 113.67,15.88 113.03,15.24 | 113.03,15.24 112.39,15.88 102.87,15.88 C3.1.2 101.6,15.88 89.53,15.88 88.9,15.24 | 88.9,15.24 88.27,15.88 78.74,15.88 C4.1.2 77.47,15.88 65.41,15.88 64.77,15.24 | 64.77,15.24 64.14,15.88 53.98,15.88 C5.1.2 52.7,15.88 40.01,15.88 39.37,15.24 | 39.37,15.24 38.73,15.88 29.21,15.88 C6.1.2 27.94,15.88 15.88,15.88 15.24,15.24 | 15.24,15.24 14.61,15.88 11.11,15.88 10.16,16.83 IC1.7 10.16,23.5 10.79,24.13 17.14,24.13 17.78,23.5 IC1.4 | IC1.12 15.24,15.24 | IC2.12 39.37,15.24 | IC3.12 64.77,15.24 | IC4.12 88.9,15.24 | IC5.12 113.03,15.24 | IC13.1 144.06,59.97 143.78,59.69
  Bottom 0.406: IC8.1 IC11.4 91.44,33.66 92.71,32.38 | 102.62,32.38 C13.1.- | 106.3,32.64 109.22,35.56 IC7.8 114.3,37.47 116.2,39.37 120.65,39.37 121.92,40.64 IC12.6 121.92,44.45 | 121.92,44.45 125.73,44.45 127,43.18 IC12.8 | IC12.3 121.92,44.45 | IC7.2 129.54,33.66 132.08,31.11 C12.3.-
  pour Bottom (isolate 0.61, rank 3): 1.27,78.74 1.27,1.27 157.25,1.27 157.25,78.74
GPIO0
  Top 0.406: IC14.12 130.8,62.54 129.86,61.59 129.86,53.98 127.95,52.07 113.03,52.07 110.49,54.61 R14.3.1
  Bottom 0.406: T14.2.3 104.46,54.29 108.9,54.29 R14.3.1
GPIO12
  Top 0.406: IC14.6 114.08,60.54 107.31,67.31 88.27,67.31 83.82,71.75 JP5.3
GPIO14
  Top 0.406: IC14.5 115.57,62.55 109.86,68.26 89.85,68.26 86.36,71.75 JP5.4
GPIO16
  Top 0.406: IC14.4 114.85,64.54 110.17,69.22 91.12,69.22 88.9,71.44 JP5.5
HE0
  Bottom 0.406: IC2.16 49.53,12.06 50.8,10.79 50.8,3.81 49.53,2.54 SV2.1
HE1
  Bottom 0.406: SV2.2 46.99,6.35 IC2.15
HE2  (via drill 0.8)
  Top 0.406: v51.44,23.5 32.38,23.5 31.75,22.86 IC2.8
  Bottom 0.406: SV2.3 46.99,3.81 48.9,3.81 49.53,4.45 49.53,10.16 48.26,11.43 48.26,15.24 51.44,18.41 v51.44,23.5
HE3
  Bottom 0.406: SV2.4 45.72,15.4 44.45,16.67 32.54,16.67 31.75,15.88 IC2.9
HE4
  Bottom 0.406: SV2.5 44.45,3.81 44.45,10.16 41.91,12.7 IC2.13
HE5
  Bottom 0.406: SV2.6 43.18,10.16 40.64,12.7 40.64,15.24 41.27,15.88 43.81,15.88 44.45,15.24 IC2.14
HE6
  Bottom 0.406: SV2.7 41.91,3.81 41.91,10.16 40.64,11.43 38.1,11.43 36.83,12.7 IC2.11
HE7
  Bottom 0.406: SV2.8 40.64,9.53 39.53,10.64 35.08,10.64 34.29,11.43 IC2.10
HE8
  Bottom 0.406: SV2.9 39.37,3.81 39.37,8.57 38.42,9.53 32.07,9.53 30.48,11.11 30.48,16.99 31.43,17.94 48.26,17.94 49.53,19.21 IC2.1
HE9
  Bottom 0.406: SV2.10 38.1,7.62 37.31,8.41 31.59,8.41 29.69,10.32 29.69,17.78 30.64,18.73 45.72,18.73 46.99,20 IC2.2
HP
  Bottom 0.406: IC9.11 18.41,24.77 14.61,24.77 13.97,24.13 13.97,19.68 13.34,19.05 12.06,19.05 11.43,19.68 11.43,24.13 10.16,25.4 R16.1
HP1
  Bottom 0.406: SV1.7 SV1.6 20.32,6.35 18.89,7.78 T9.1.C
HV_IN
  Bottom 1.27: 34.92,52.7 35.24,53.02
  Bottom 1.778: C10.1.+ 52.07,52.07 C10.2.1 42.55,52.07 41.91,52.7 IC10.6 IC10.7 IC10.8 35.24,53.02 36.83,51.44 IC10.1 | L10.1.1 34.92,52.7
  Bottom 1.93: T10.1.D 55.88,53.34 54.61,52.07 52.07,52.07
HZ0
  Bottom 0.406: SV1.1 26.67,3.81 26.67,11.43 25.4,12.7 IC1.16
HZ1
  Bottom 0.406: SV1.2 25.4,9.53 22.86,12.06 IC1.15
HZ2
  Bottom 0.406: SV1.3 24.13,3.81 24.13,8.89 21.59,11.43 21.59,15.88 20.32,17.14 8.26,17.14 7.62,17.78 IC1.8
HZ3
  Bottom 0.406: SV1.4 22.86,8.1 19.05,11.91 19.05,14.92 18.1,15.88 8.57,15.88 7.62,14.92 IC1.9
ME0
  Bottom 0.406: IC4.16 99.06,3.81 97.79,2.54 SV4.1
ME1
  Bottom 0.406: SV4.2 IC4.15
ME2  (via drill 0.8)
  Top 0.406: v100.97,23.5 81.92,23.5 81.28,22.86 IC4.8
  Bottom 0.406: SV4.3 95.25,3.81 97.16,3.81 97.79,4.45 97.79,15.24 100.97,18.41 v100.97,23.5
ME3
  Bottom 0.406: IC4.9 81.28,15.4 82.55,16.67 94.3,16.67 95.25,15.72 95.25,11.43 93.98,10.16 SV4.4
ME4
  Bottom 0.406: SV4.5 92.71,3.81 92.71,11.43 91.44,12.7 IC4.13
ME5
  Bottom 0.406: SV4.6 91.44,11.43 90.17,12.7 90.17,15.24 90.81,15.88 93.34,15.88 93.98,15.24 IC4.14
ME6
  Bottom 0.406: SV4.7 90.17,3.81 90.17,10.16 88.9,11.43 87.63,11.43 86.36,12.7 IC4.11
ME7
  Bottom 0.406: SV4.8 88.9,9.37 87.63,10.64 85.09,10.64 83.82,11.91 IC4.10
ME8
  Bottom 0.406: IC4.1 99.06,19.21 97.79,17.94 80.8,17.94 80.01,17.14 80.01,10.79 80.96,9.84 86.68,9.84 87.63,8.89 87.63,3.81 SV4.9
ME9
  Bottom 0.406: IC4.2 96.52,20 95.25,18.73 80.01,18.73 79.22,17.94 79.22,10.16 80.33,9.05 85.41,9.05 86.36,8.1 SV4.10
MZ0
  Bottom 0.406: IC3.16 74.93,12.06 76.2,10.79 76.2,3.81 74.93,2.54 SV3.1
MZ1
  Bottom 0.406: SV3.2 72.39,6.35 IC3.15
MZ2  (via drill 0.8)
  Top 0.406: v76.83,23.5 58.1,23.5 57.15,22.54 IC3.8
  Bottom 0.406: SV3.3 72.39,3.81 74.3,3.81 74.93,4.45 74.93,10.16 73.66,11.43 73.66,15.24 76.83,18.41 v76.83,23.5
MZ3
  Bottom 0.406: SV3.4 71.12,15.4 69.85,16.67 58.42,16.67 57.15,15.4 IC3.9
MZ4
  Bottom 0.406: SV3.5 69.85,3.81 69.85,10.16 67.31,12.7 IC3.13
MZ5
  Bottom 0.406: SV3.6 68.58,10.16 66.04,12.7 66.04,15.24 66.67,15.88 69.22,15.88 69.85,15.24 IC3.14
MZ6
  Bottom 0.406: SV3.7 67.31,3.81 67.31,10.16 66.04,11.43 63.5,11.43 62.23,12.7 IC3.11
MZ7
  Bottom 0.406: SV3.8 66.04,9.53 65.09,10.48 60.64,10.48 59.69,11.43 IC3.10
MZ8
  Bottom 0.406: IC3.1 74.93,19.21 73.66,17.94 56.2,17.94 55.4,17.14 55.4,10.79 56.52,9.68 63.82,9.68 64.77,8.73 64.77,3.81 SV3.9
MZ9
  Bottom 0.406: IC3.2 72.39,20 71.12,18.73 55.56,18.73 54.61,17.78 54.61,10.16 55.88,8.89 62.71,8.89 63.5,8.1 SV3.10
N$1
  Bottom 0.406: IC9.4 26.67,34.29 27.3,33.66 33.18,33.66 34.29,32.54 34.29,30.48 35.56,29.21 39.53,29.21 41.43,27.3 41.43,24.29 42.23,23.5 43.66,23.5 44.45,22.7 IC2.3
N$2
  Bottom 0.406: IC2.6 36.83,22.86 33.02,26.67 33.02,31.59 31.91,32.7 24.77,32.7 24.13,33.34 IC9.5
N$3
  Bottom 0.406: IC9.6 21.59,32.38 22.23,31.75 28.57,31.75 30.48,29.84 30.48,26.67 34.29,22.86 IC2.7
N$4
  Bottom 0.406: IC9.7 19.05,31.43 19.68,30.8 26.67,30.8 27.94,29.53 27.94,26.04 30.48,23.5 32.38,23.5 33.02,22.86 33.02,20.16 33.66,19.53 41.27,19.53 41.91,20.16 IC2.4
N$5
  Bottom 0.406: IC1.3 20.32,23.5 20.95,24.13 23.5,24.13 25.4,26.04 25.4,29.21 24.77,29.84 17.14,29.84 16.51,29.21 IC9.9
N$6
  Bottom 0.406: IC1.6 12.7,24.77 13.97,26.04 17.78,26.04 19.05,27.3 IC9.10
N$7
  Top 0.406: R16.2 9.53,34.92 8.26,33.66 6.35,33.66 5.08,32.38 5.08,13.34 6.35,12.06 11.43,12.06 14.45,9.05 T9.1.B
N$8
  Top 0.406: R17.2 5.08,35.56 3.81,34.29 3.81,10.16 4.92,9.05 T9.2.B
N$9
  Bottom 0.406: IC4.3 93.98,22.23 92.71,23.5 90.17,23.5 83.82,29.84 83.82,32.54 82.71,33.66 75.56,33.66 74.93,34.29 IC8.4
N$10
  Bottom 0.406: IC8.5 72.39,33.66 73.18,32.86 80.49,32.86 81.28,32.07 81.28,26.83 82.07,26.04 84.45,26.04 86.36,24.13 IC4.6
N$11
  Bottom 0.406: IC4.7 83.82,24.13 82.71,25.24 79.85,25.24 78.74,26.35 78.74,31.43 78.11,32.07 70.64,32.07 69.85,32.86 IC8.6
N$12
  Bottom 0.406: IC4.4 91.44,20.16 90.81,19.53 83.19,19.53 82.55,20.16 82.55,23.65 81.92,24.29 78.58,24.29 76.2,26.67 76.2,30.48 75.41,31.27 68.42,31.27 67.31,32.38 IC8.7
N$13
  Bottom 0.406: IC3.3 69.85,24.77 69.22,25.4 65.41,25.4 64.77,26.04 IC8.9
N$14
  Bottom 0.406: IC3.6 62.23,28.57 63.34,29.69 66.67,29.69 67.31,29.05 IC8.10
N$15
  Bottom 0.406: IC3.7 59.69,29.53 60.64,30.48 69.22,30.48 69.85,29.84 IC8.11
N$16
  Bottom 0.406: IC3.4 67.31,20.32 68.1,19.53 70.48,19.53 71.12,20.16 71.12,24.77 72.39,26.04 IC8.12
N$17
  Bottom 0.406: IC7.4 124.46,34.29 125.73,33.02 127.64,33.02 130.81,29.84 136.53,29.84 142.24,24.13 IC6.3
N$18
  Bottom 0.406: IC6.6 134.62,23.5 132.72,25.4 128.91,25.4 128.27,26.04 128.27,29.21 125.73,31.75 124.46,31.75 121.92,34.29 IC7.5
N$19
  Bottom 0.406: IC6.7 132.08,22.86 131.44,23.5 126.68,23.5 125.41,24.77 124.14,24.77 123.19,25.72 123.19,29.84 119.38,33.66 IC7.6
N$20
  Bottom 0.406: IC7.7 116.84,36.83 118.11,38.1 119.38,38.1 120.65,36.83 120.65,34.29 125.73,29.21 125.73,25.72 127,24.45 131.92,24.45 133.35,23.02 133.35,20.16 133.99,19.53 139.06,19.53 139.7,20.16 IC6.4
N$21
  Bottom 0.406: IC7.9 114.3,29.84 114.94,30.48 117.47,30.48 118.11,29.84 IC5.3
N$22
  Bottom 0.406: IC5.6 110.49,22.86 113.03,25.4 116.2,25.4 116.84,26.04 IC7.10
N$23
  Bottom 0.406: IC5.7 107.95,24.45 112.39,28.89 112.39,30.8 113.03,31.43 118.75,31.43 119.38,30.8 IC7.11
N$24
  Bottom 0.406: IC5.4 115.57,20.32 116.2,19.68 118.75,19.68 119.38,20.32 119.38,24.77 120.02,25.4 121.28,25.4 121.92,26.04 IC7.12
N$25
  Bottom 0.406: Q1.1 98.36,38.16 99.06,37.47 IC11.1
N$26
  Bottom 0.406: Q1.2 97.22,40.7 96.52,40.01 IC11.2
N$27
  Bottom 0.406: IC11.3 93.98,43.18 B1.+
N$28
  Top 0.61: IC14.10 138.94,58.54 139.7,57.78 R14.5.2
N$30
  Bottom 0.61: IC10.3 C10.3.1
N$31
  Bottom 0.61: IC10.2 39.37,41.91 38.1,40.64 R10.1.2 31.75,40.64 T10.2.G
N$32
  Bottom 1.27: 25.4,53.34 25.4,52.66 L10.1.2
  Bottom 1.778: T10.2.D 25.4,52.66 | D10.1.A 25.4,53.34
N$33
  Bottom 1.016: IC12.7 124.46,40.01 125.09,39.37 D12.2.K 133.99,39.37 135.89,41.27 L12.1.1
N$34
  Bottom 0.61: 17.78,59.69 R10.4.2 20.95,61.59 25.4,57.15 43.18,57.15 44.45,55.88 IC10.5 | R1.A 11.43,68.58 13.97,66.04 13.97,63.5 17.78,59.69 | C10.4.1 17.78,59.69
N$35
  Bottom 0.61: R1.S 15.24,73.66 17.78,71.12 R1.E 19.68,66.67 R10.2.1
N$36
  Top 0.61: LED12.1.A R12.1.1
N$37
  Bottom 0.61: Q2.C T10.1.G R10.3.1
N$38
  Bottom 1.93: F1.2 60.78,66.97 59.21,65.41 D12.1.A
N$39
  Top 0.61: IC14.11 141.39,60.54 142.24,59.69 R14.4.1
N$41
  Bottom 0.61: Q2.B R2.2 R10.5.1
N$42
  Top 0.61: R14.1.1 120.64,66.67 IC14.3
N$44
  Bottom 0.406: R14.7.2 95.89,56.52 97.16,57.78 T14.2.2
N$45
  Bottom 0.406: R14.6.2 98.42,65.09 100.65,62.87 T14.1.2
RESET  (via drill 0.8 pad 1.27)
  Top 0.406: v97.16,71.75 98.42,71.75 99.06,71.12 114.3,71.12 114.94,70.48
  Top 0.61: IC14.1 120.72,70.48 114.94,70.48 R14.2.1
  Bottom 0.406: v97.16,71.75 97.16,62.87 99.06,60.96 T14.1.3
RTS
  Bottom 0.406: R14.7.1 95.89,62.87 97.16,61.59 99.06,59.69 104.14,59.69 T14.1.1 106.2,61.75 106.2,71.91 JP1.2
RX  (via drill 0.8 pad 1.27)
  Top 0.406: IC14.15 129.82,68.54 127.95,66.67 127.95,54.61 126.68,53.34 113.98,53.34 111.76,55.56 111.76,57.47 110.17,59.05 101.92,59.05 100.65,60.33 100.65,63.5 v101.6,64.45
  Bottom 0.406: v101.6,64.45 JP1.5
SCL
  Top 0.406: 77.47,26.04 76.2,24.77 39.69,24.77 R14.9.1 37.94,24.29 30.48,24.29 29.21,25.56 IC9.14 | 77.47,26.04 IC8.14 | IC11.6 93.98,26.04 | 93.98,26.04 92.71,24.77 78.74,24.77 77.47,26.04 | 127,26.04 125.73,24.77 95.25,24.77 93.98,26.04 | IC7.14 127,26.04 | 127,26.04 128.27,24.77 151.13,24.77 152.4,26.04 JP2.2 152.4,35.56 156.21,39.37 156.21,42.23 154.62,43.81 154.62,45.21 T14.4.3
SCL33
  Top 0.406: JP3.2 152.4,67.31 152.4,69.85 148.59,73.66 142.24,73.66 139.7,71.12 139.7,67.94 138.43,66.67 138.43,65.41 137.48,64.45 135.86,64.45 IC14.13 | T14.4.2 153.72,51.48 155.89,53.66 155.89,53.61 R14.8.1
  Bottom 0.406: JP3.2 153.62,64.77 152.67,63.82 152.67,56.83 R14.8.1
SDA
  Top 0.406: IC9.15 31.75,26.51 32.86,25.4 R14.11.1 38.73,27.3 39.69,27.3 40.96,26.04 75.41,26.04 76.2,26.83 76.2,29.84 76.83,30.48 79.38,30.48 80.01,29.84 IC8.15 80.01,26.99 80.96,26.04 90.49,26.04 91.44,26.99 IC11.5 91.44,29.84 92.08,30.48 94.61,30.48 95.25,29.84 95.25,26.83 96.04,26.04 125.09,26.04 125.73,26.67 125.73,29.84 126.36,30.48 128.91,30.48 129.54,29.84 IC7.15 129.54,26.67 130.18,26.04 148.59,26.04 149.86,27.3 JP2.1 149.86,36.83 148.64,38.05 T14.3.3
SDA33
  Top 0.406: IC14.14 137.03,66.54 137.48,66.99 137.48,67.31 138.75,68.58 138.75,71.75 141.92,74.93 148.91,74.93 153.03,70.8 156.21,70.8 157.16,69.85 157.16,64.45 JP3.1 | R14.10.1 152.19,52.55 150.97,52.55 147.69,49.26 T14.3.2
  Bottom 0.406: JP3.1 154.94,57.1 R14.10.1
SE0
  Bottom 0.406: SV6.1 146.05,2.54 147.32,3.81 IC6.16
SE1
  Bottom 0.406: SV6.2 IC6.15
SE2  (via drill 0.8)
  Top 0.406: v149.22,23.5 130.18,23.5 129.54,22.86 IC6.8
  Bottom 0.406: SV6.3 143.51,3.81 145.41,3.81 146.05,4.45 146.05,15.24 149.22,18.41 v149.22,23.5
SE3
  Bottom 0.406: SV6.4 142.24,10.16 143.51,11.43 143.51,16.03 142.72,16.83 130.65,16.83 129.54,15.72 IC6.9
SE4
  Bottom 0.406: SV6.5 140.97,3.81 140.97,10.72 139.7,11.99 IC6.13
SE5
  Bottom 0.406: IC6.14 142.24,15.24 141.6,15.88 139.06,15.88 138.43,15.24 138.43,11.43 139.7,10.16 SV6.6
SE6
  Bottom 0.406: SV6.7 138.43,3.81 138.43,8.32 134.62,12.13 IC6.11
SE7
  Bottom 0.406: SV6.8 137.16,7.45 132.08,12.53 IC6.10
SE8
  Bottom 0.406: SV6.9 135.89,3.81 135.89,7.14 134.62,8.41 129.54,8.41 128.43,9.53 128.43,17.3 128.91,17.78 146.37,17.78 147.32,18.73 IC6.1
SE9
  Bottom 0.406: IC6.2 144.78,19.68 143.67,18.57 128.43,18.57 127.64,17.78 127.64,8.89 128.91,7.62 133.67,7.62 134.62,6.67 SV6.10
SW_HV
  Top 0.406: IC14.7 114.18,58.54 106.36,66.36 101.28,66.36 98.74,63.82 86.68,63.82 78.74,55.88 67.31,55.88 66.04,57.15 R10.5.2
SZ0
  Bottom 0.406: SV5.1 123.19,2.54 124.46,3.81 124.46,11.43 123.19,12.7 IC5.16
SZ1
  Bottom 0.406: IC5.15 120.65,6.35 SV5.2
SZ2  (via drill 0.8)
  Top 0.406: v124.78,23.5 106.05,23.5 105.41,22.86 IC5.8
  Bottom 0.406: SV5.3 120.65,3.81 122.56,3.81 123.19,4.45 123.19,11.43 121.92,12.7 121.92,16.35 124.78,19.21 v124.78,23.5
SZ3
  Bottom 0.406: SV5.4 119.38,15.4 118.11,16.67 106.68,16.67 105.41,15.4 IC5.9
SZ4
  Bottom 0.406: SV5.5 118.11,3.81 118.11,9.84 115.57,12.38 IC5.13
SZ5
  Bottom 0.406: SV5.6 116.84,8.89 114.3,11.43 114.3,15.24 114.94,15.88 117.47,15.88 118.11,15.24 IC5.14
SZ6
  Bottom 0.406: SV5.7 115.57,3.81 115.57,8.89 114.94,9.53 111.44,9.53 110.49,10.48 IC5.11
SZ7
  Bottom 0.406: SV5.8 114.3,7.94 113.51,8.73 108.9,8.73 107.95,9.68 IC5.10
SZ8
  Bottom 0.406: SV5.9 113.03,3.81 113.03,6.83 112.24,7.62 105.41,7.62 104.14,8.89 104.14,17.3 104.93,18.1 122.24,18.1 123.19,19.05 IC5.1
SZ9
  Bottom 0.406: IC5.2 120.65,19.68 119.86,18.89 104.46,18.89 103.35,17.78 103.35,8.41 104.93,6.83 110.97,6.83 111.76,6.03 SV5.10
TX  (via drill 0.8 pad 1.27)
  Top 0.406: 135.72,70.48 127.95,70.48 126.05,68.58 126.05,55.24 125.41,54.61 114.62,54.61 113.35,55.88 113.35,57.15 105.41,65.09 v104.14,65.09
  Top 0.61: 135.72,70.48 IC14.16
  Bottom 0.406: v104.14,65.09 JP1.4
V_A
  Bottom 0.61: C10.5.+ 3.81,39.37 3.81,9.53 8.26,5.08 SV1.10 | R10.2.2 7.62,63.5 7.62,58.42 8.89,57.15 D10.1.C
  Bottom 1.27: 8.89,44.45 C10.5.+ | D10.1.C 8.89,52.7
  Bottom 1.778: D10.1.C 8.89,44.45
VCC  (via drill 0.8, 0.8 pad 1.27)
  Top 0.406: IC9.3 IC9.2 IC9.1 IC9.16 34.6,28.25 C9.1.1 | IC8.2 80.01,33.02 82.55,30.48 IC8.16 85.09,27.94 86.36,29.21 C8.1.1 | 132.08,33.02 IC7.16 133.99,27.94 C7.1.1 | 132.08,33.02 IC7.1 | IC7.3 127,33.66 127.64,33.02 132.08,33.02 | R12.1.2 68.58,46.95 74.93,40.6 v77.47,40.6 | IC13.3 150.5,54.94 v146.69,51.12
  Top 0.61: C1.1.1 150.34,19.53 137.95,19.53 137.16,20.32 | 137.16,20.32 136.37,19.53 127.16,19.53 C2.1.1 125.57,19.53 113.82,19.53 113.03,20.32 | IC6.5 137.16,20.32 | 113.03,20.32 112.24,19.53 103.03,19.53 C3.1.1 101.44,19.53 89.69,19.53 88.9,20.32 | 88.9,20.32 88.11,19.53 78.9,19.53 C4.1.1 77.31,19.53 65.56,19.53 64.77,20.32 | 64.77,20.32 63.98,19.53 54.13,19.53 C5.1.1 52.55,19.53 40.16,19.53 39.37,20.32 | 39.37,20.32 38.58,19.53 29.37,19.53 C6.1.1 27.78,19.53 16.03,19.53 15.24,20.32 IC1.5 | IC3.5 64.77,20.32 | 88.9,20.32 IC4.5 | IC5.5 113.03,20.32 | IC2.5 39.37,20.32 | JP5.1 v78.74,59.69
  Bottom 0.406: IC2.5 39.37,22.86 40.64,24.13 40.64,26.67 39.37,27.94 IC9.16 | IC8.16 84.45,27.94 88.9,23.5 IC4.5 | IC8.2 IC8.3 v77.47,40.6 | 102.87,27.94 102.87,20.95 C3.1.1 | IC7.16 137.16,22.86 IC6.5 | IC12.1 128.91,51.44 142.88,51.44 144.15,50.16 C12.3.+ 146.69,33.66 v146.69,51.12
  Bottom 0.61: IC11.8 102.87,27.94 C13.1.+ 102.78,30.96 101.6,30.96 100.33,32.23 100.33,40.64 81.28,59.69 v78.74,59.69 | R14.9.2 R14.11.2 IC9.1
  Bottom 1.016: L12.1.2 140.97,34.29 C12.3.+
  Bottom 1.27: C12.3.+ 144.78,31.11 151.13,24.77 C1.1.1
VIN
  Bottom 1.93: X1.1 32.51,68.7 36.2,72.39 F1.1
  pour Bottom (isolate 0.61): 30.48,71.12 26.67,71.12 25.4,69.85 25.4,67.31 26.67,66.04 35.56,66.04 38.1,68.58 39.37,68.58 40.64,69.85 40.64,74.93 39.37,76.2 35.56,76.2

### Text on the board
Top: 630mA t | adjust | ISP | GND | VCC | VL2320 | Anodenspg | Nixie-Treiber1.0 | SDA | 111 | 101 | GND | 110 | 0x68 | SCL | Std-Z | Std-E | Min-Z | Min-E | Sek-Z | Sek-E | BS | Nixie Treiber | V+ | 1
Bottom: 630mA t | EXT | Nixie-Treiber 1.0 / NTP-Time Server | +12V | V+ reg | ESP8266 | 42nibbles.de | Nixie-Treiber 1.0
tPlace: E07 | ESP8266